# Altium schematic sheet RTDsSheet3.SchDoc
size A4
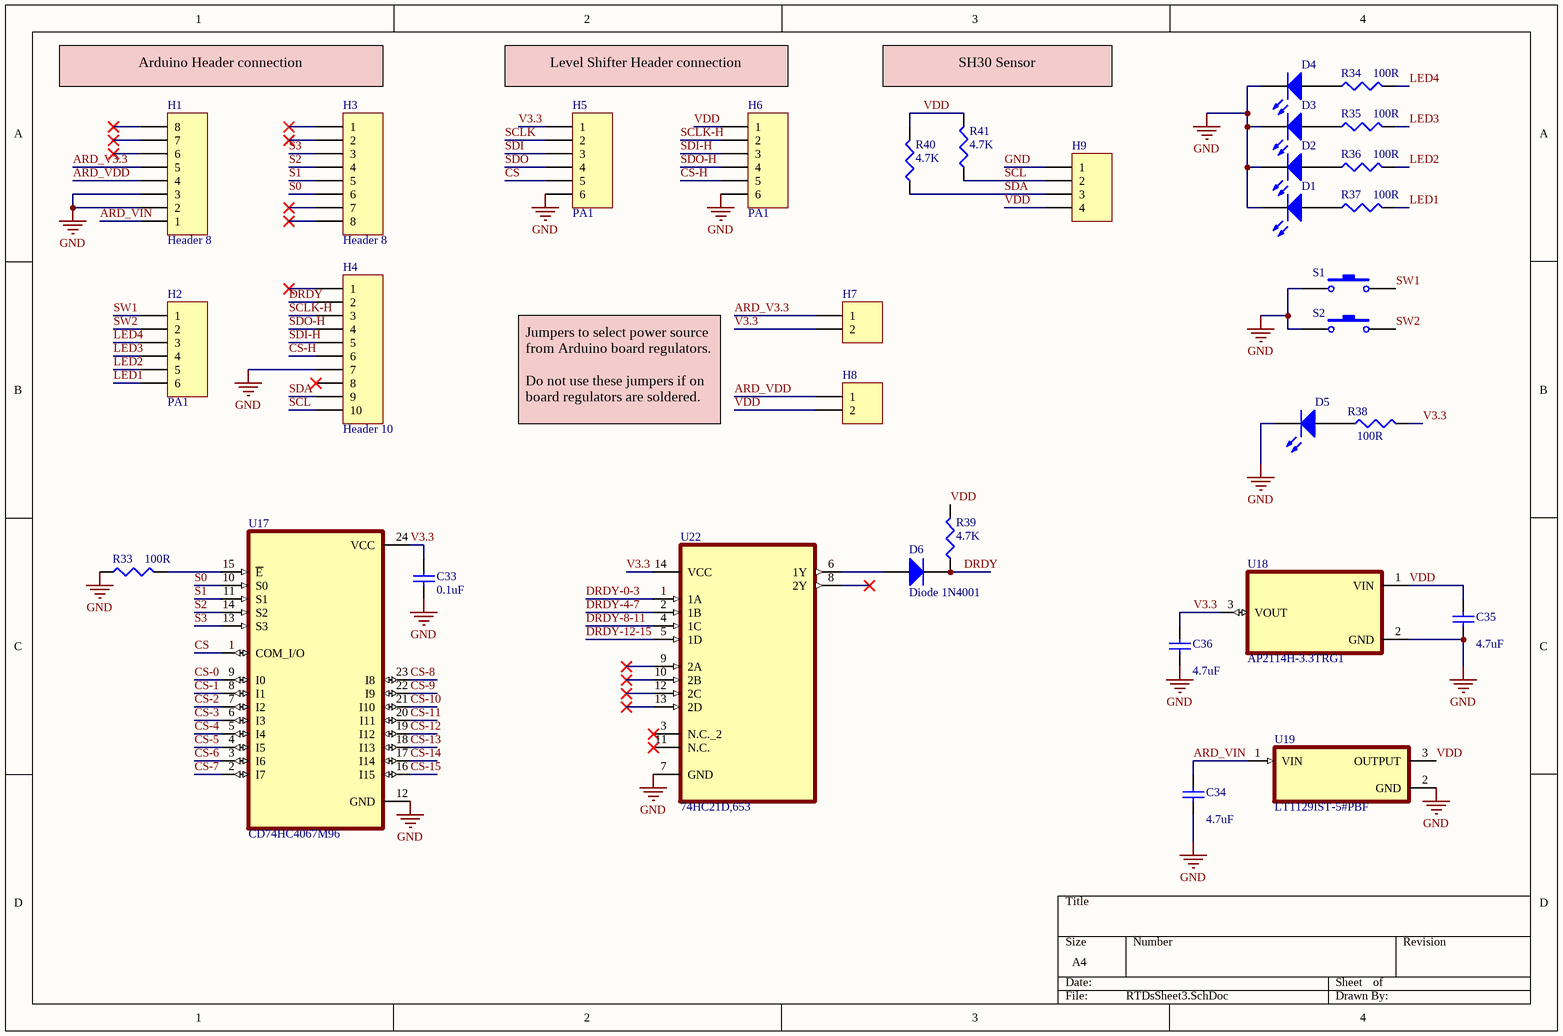
[diagram p0: RTDsSheet3.SchDoc]

## Parts
C33  value 0.1uF  [1608[0603]]
C34  value 4.7uF  [C0805]
C35  value 4.7uF  [C0805]
C36  value 4.7uF  [C0805]
D1  (no value)  [6-0805_N]
D2  (no value)  [6-0805_N]
D3  (no value)  [6-0805_N]
D4  (no value)  [6-0805_N]
D5  (no value)  [6-0805_N]
D6  Diode 1N4001  [C0805]
H1  Header 8  [HDR1X8]
H2  PA1  [HDR1X6]
H3  Header 8  [HDR1X8]
H4  Header 10  [HDR1X10]
H5  PA1  [HDR1X6]
H6  PA1  [HDR1X6]
H7  (no value)  [HDR1X2]
H8  (no value)  [HDR1X2]
H9  (no value)  [HDR1X4]
R33  value 100R  [J1-0603]
R34  value 100R  [J1-0603]
R35  value 100R  [J1-0603]
R36  value 100R  [J1-0603]
R37  value 100R  [J1-0603]
R38  value 100R  [J1-0603]
R39  value 4.7K  [J1-0603]
R40  value 4.7K  [J1-0603]
R41  value 4.7K  [J1-0603]
S1  (no value)  [PTS525SM08SMTR2LFS]
S2  (no value)  [PTS525SM08SMTR2LFS]
U17  CD74HC4067M96  [SOIC127P1030X265-24N]
U18  AP2114H-3.3TRG1  [SOT230P700X180-4N]
U19  LT1129IST-5#PBF  [SOT230P700X180-4N]
U22  74HC21D,653  [SOIC127P600X175-14N]

## Nets
GND: C33.2 C34.1 C35.1 C36.1 D1.2(K) D2.2(K) D3.2(K) D4.2(K) D5.2(K) H1.2 H1.3 H4.7 H5.6 H6.6 H9.1 R33.2 S1.1 S2.1 U17.12(GND) U18.2(GND) U19.2(GND) U22.7(GND)
ARD_V3.3: H1.5 H7.1
ARD_VDD: H1.4 H8.1
ARD_VIN: C34.2 H1.1 U19.1(VIN)
CS: H5.5 U17.1(COM_I/O)
CS-0: U17.9(I0)
CS-1: U17.8(I1)
CS-2: U17.7(I2)
CS-3: U17.6(I3)
CS-4: U17.5(I4)
CS-5: U17.4(I5)
CS-6: U17.3(I6)
CS-7: U17.2(I7)
CS-8: U17.23(I8)
CS-9: U17.22(I9)
CS-10: U17.21(I10)
CS-11: U17.20(I11)
CS-12: U17.19(I12)
CS-13: U17.18(I13)
CS-14: U17.17(I14)
CS-15: U17.16(I15)
CS-H: H4.6 H6.5
DRDY: D6.2(K) H4.2 R39.2
DRDY-0-3: U22.1(1A)
DRDY-4-7: U22.2(1B)
DRDY-8-11: U22.4(1C)
DRDY-12-15: U22.5(1D)
LED1: H2.6 R37.1
LED2: H2.5 R36.1
LED3: H2.4 R35.1
LED4: H2.3 R34.1
S0: H3.6 U17.10(S0)
S1: H3.5 U17.11(S1)
S2: H3.4 U17.14(S2)
S3: H3.3 U17.13(S3)
SCL: H4.10 H9.2 R41.2
SCLK: H5.2
SCLK-H: H4.3 H6.2
SDA: H4.9 H9.3 R40.2
SDI: H5.3
SDI-H: H4.5 H6.3
SDO: H5.4
SDO-H: H4.4 H6.4
SW1: H2.1 S1.2
SW2: H2.2 S2.2
V3.3: C33.1 C36.2 H5.1 H7.2 R38.1 U17.24(VCC) U18.3(VOUT) U22.14(VCC)
VDD: C35.2 H6.1 H8.2 H9.4 R39.1 R40.1 R41.1 U18.1(VIN) U19.3(OUTPUT)
NetD1_1: D1.1(A) R37.2
NetD2_1: D2.1(A) R36.2
NetD3_1: D3.1(A) R35.2
NetD4_1: D4.1(A) R34.2
NetD5_1: D5.1(A) R38.2
NetD6_1: D6.1(A) U22.6(1Y)
NetR33_1: R33.1 U17.15(~{E})

Not connected (* = marked no-connect by the designer): H1 6* 7* 8*; H3 1* 2* 7* 8*; H4 1* 8*; U22 3(N.C._2)* 8(2Y)* 9(2A)* 10(2B)* 11(N.C.)* 12(2C)* 13(2D)*

## Notes on the sheet
- Arduino Header connection
- Level Shifter Header connection
- SH30 Sensor
- Jumpers to select power source from Arduino board regulators.
  Do not use these jumpers if on board regulators are soldered.

## Library data of the parts
C33-C36 = Cap Semi: Capacitor (Semiconductor SIM Model); Published: 8-Jun-2000; LatestRevisionDate: 29-May-2009; LatestRevisionNote: IPC-7351 Footprint Added.; PackageReference: C1206; Publisher: Altium Limited; PackageDescription: Chip Capacitor
D1-D5 = LED3: Typical BLUE SiC LED; Published: 8-Jun-2000; LatestRevisionDate: 17-Dec-2003; LatestRevisionNote: PCB Footprint replaced.; DatasheetVersion: 16-Apr-2002; PackageVersion: 16-Apr-2002; PackageReference: 3.5X2.8X1.9; Publisher: Altium Limited; PackageDescription: SM LED; 2 C-Bend Leads; Body 3.5 x 2.8 x 1.9 mm, inc leads (LxWxH typ)
D6 = Diode 1N4001: 1 Amp General Purpose Rectifier; Published: 8-Jun-2000; LatestRevisionDate: 17-Jul-2002; LatestRevisionNote: Re-released for DXP Platform.; DatasheetVersion: 1998; PackageVersion: Aug-1999; PackageReference: DO-41; Publisher: Altium Limited; PackageDescription: Diode, Axial; Body 5.2 x 2.7 mm (LxDia. max), Lead Dia. 0.86 mm (max); Code_JEDEC: DO-204-AL; ComponentLink1Description: Manufacturer Link; ComponentLink1URL: http://www.fairchildsemi.com/; ComponentLink2Description: Datasheet; ComponentLink2URL: http://www.fairchildsemi.com/ds/1N%2F1N4001.pdf
H1 H3 = Header 8: Header, 8-Pin; LatestRevisionDate: 17-Jul-2002; LatestRevisionNote: Re-released for DXP Platform.; Publisher: Altium Limited
H2 H5 H6 = Header 6: Header, 6-Pin; LatestRevisionDate: 17-Jul-2002; LatestRevisionNote: Re-released for DXP Platform.; Publisher: Altium Limited
H4 = Header 10: Header, 10-Pin; LatestRevisionDate: 17-Jul-2002; LatestRevisionNote: Re-released for DXP Platform.; Publisher: Altium Limited
H7 H8 = Header 2: Header, 2-Pin; LatestRevisionDate: 17-Jul-2002; LatestRevisionNote: Re-released for DXP Platform.; Publisher: Altium Limited
H9 = Header 4: Header, 4-Pin; LatestRevisionDate: 17-Jul-2002; LatestRevisionNote: Re-released for DXP Platform.; Publisher: Altium Limited
R33-R41 = Res3: Resistor; Published: 8-Jun-2000; LatestRevisionDate: 29-May-2009; LatestRevisionNote: IPC-7351 Footprint Added.; PackageReference: J1-0603; Publisher: Altium Limited; PackageDescription: Chip Resistor
S1 S2 = SW-PB: Switch; Published: 24-Mar-1999; LatestRevisionDate: 17-Jul-2002; LatestRevisionNote: Re-released for DXP Platform.; PackageReference: SPST-2; Publisher: Altium Limited; PackageDescription: Switch; 2 Leads
U17 = CD74HC4067M96: MF: {'manufacturer': u'Texas Instruments'}; Value: *; Package: None; Price: None; MP: CD74HC4067M96; Availability: Unavailable
U18 = AP2114H-3.3TRG1: MF: {'manufacturer': u'Diodes Inc.'}; Price: None; Availability: Unavailable; Value: *; MP: AP2114H-3.3TRG1; Package: None
U19 = LT1129IST-5#PBF: MF: {'manufacturer': u'Analog Devices'}; Availability: Unavailable; Price: None; Value: *; MP: LT1129IST-5#PBF; Package: None
U22 = 74HC21D,653: Dual 4-input AND gate; MF: {'manufacturer': u'Nexperia USA'}; Value: *; Availability: Unavailable; Price: None; Package: None; MP: 74HC21D,653